# EAGLE design CP Sapling (EAGLE 9.5.2)
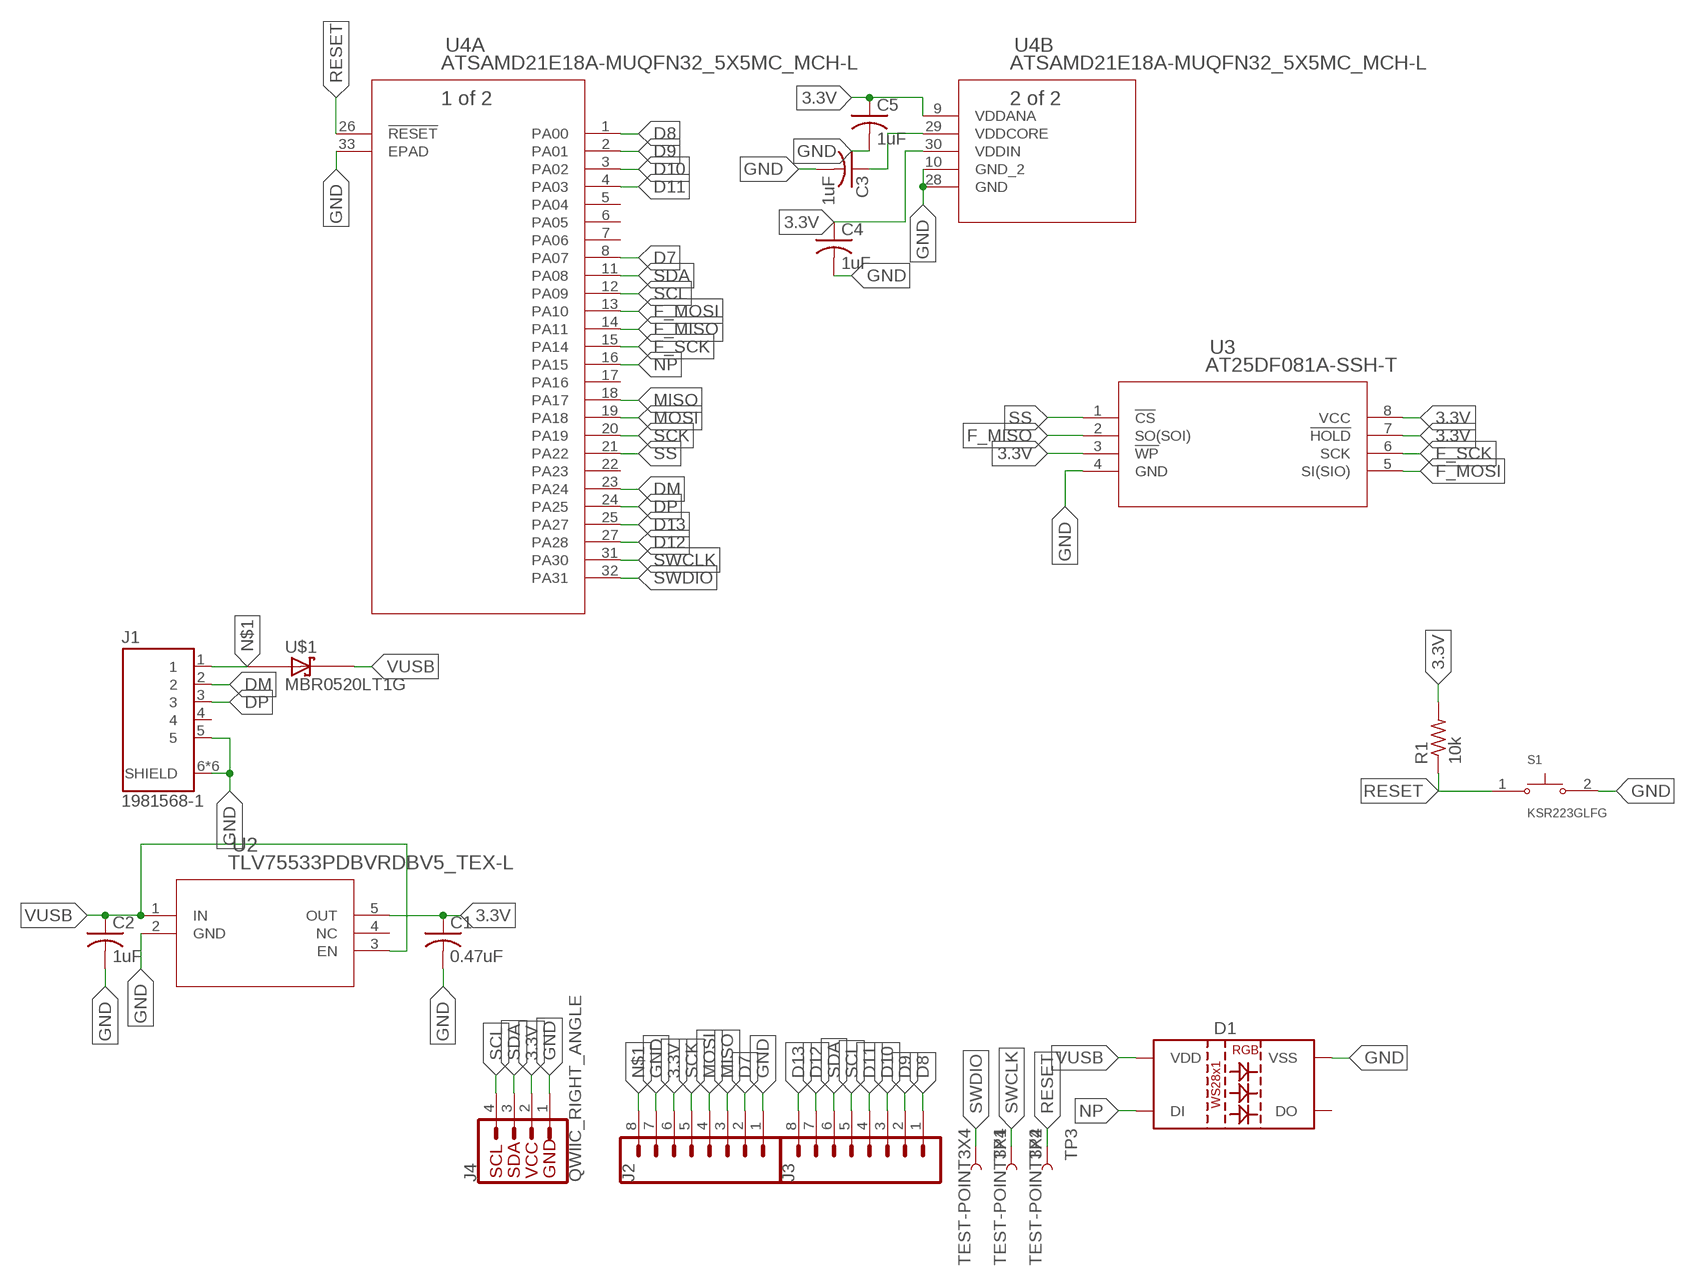
[diagram p0: schematic, sheet 1]

## Parts
C1  0.47uF  C-USC0402  [C0402]
C2  1uF  C-USC0402  [C0402]
C3  1uF  C-USC0402  [C0402]
C4  1uF  C-USC0402  [C0402]
C5  1uF  C-USC0402  [C0402]
D1  WS2812B  WS2812BWS2812B-3535  [WS2812-3535]
J1  1981568-1  [TE_1981568-1]
J2  CONN_08NO_SILK_DNP  [1X08_NO_SILK]
J3  CONN_08NO_SILK_DNP  [1X08_NO_SILK]
J4  QWIIC_RIGHT_ANGLE  QWIIC_CONNECTORJS-1MM  [JST04_1MM_RA]
R1  10k  R-US_R0402  [R0402]
S1  KSR223GLFG  [SW_KSR223GLFG]
TP1  TEST-POINT3X4  [PAD.03X.04]
TP2  TEST-POINT3X4  [PAD.03X.04]
TP3  TEST-POINT3X4  [PAD.03X.04]
U2  TLV75533PDBVRDBV5_TEX-L  [DBV5_TEX-L]
U3  AT25DF081A-SSH-T  [SOIC_AT25DF081_ADO]
U4  ATSAMD21E18A-MUQFN32_5X5MC_MCH-L  [QFN32_5X5MC_MCH-L]
U$1  MBR0520LT1G  [SOD3716X117(SOD-123)]

## Nets
3.3V: C1.1 C4.1 C5.1 J2.6 J4.2 R1.2 U2.5(OUT) U3.3(!WP) U3.7(!HOLD) U3.8(VCC) U4.9(B:VDDANA) U4.30(B:VDDIN)
D7: J2.2 U4.8(A:PA07)
D8: J3.1 U4.1(A:PA00)
D9: J3.2 U4.2(A:PA01)
D10: J3.3 U4.3(A:PA02)
D11: J3.4 U4.4(A:PA03)
D12: J3.7 U4.27(A:PA28)
D13: J3.8 U4.25(A:PA27)
DM: J1.2 U4.23(A:PA24)
DP: J1.3 U4.24(A:PA25)
F_MISO: U3.2(SO(SOI)) U4.14(A:PA11)
F_MOSI: U3.5(SI(SIO)) U4.13(A:PA10)
F_SCK: U3.6(SCK) U4.15(A:PA14)
GND: C1.2 C2.2 C3.2 C4.2 C5.2 D1.VSS J1.5 J1.6(SHIELD) J1.7(SHIELD) J1.8(SHIELD) J1.9(SHIELD) J1.10(SHIELD) J1.11(SHIELD) J2.1 J2.7 J4.1 S1.2 U2.2(GND) U3.4(GND) U4.10(B:GND_2) U4.28(B:GND) U4.33(A:EPAD)
MISO: J2.3 U4.18(A:PA17)
MOSI: J2.4 U4.19(A:PA18)
N$1: J1.1 J2.8 U$1.2(A)
N$2: C3.1 U4.29(B:VDDCORE)
NP: D1.DIN(DI) U4.16(A:PA15)
RESET: R1.1 S1.1 TP3.P$1 U4.26(A:!RESET)
SCK: J2.5 U4.20(A:PA19)
SCL: J3.5 J4.4 U4.12(A:PA09)
SDA: J3.6 J4.3 U4.11(A:PA08)
SS: U3.1(!CS) U4.21(A:PA22)
SWCLK: TP2.P$1 U4.31(A:PA30)
SWDIO: TP1.P$1 U4.32(A:PA31)
VUSB: C2.1 D1.VDD U2.1(IN) U2.3(EN) U$1.1(C)
Unconnected: D1.DOUT(DO) J1.4 U2.4(NC) U4.5(A:PA04) U4.6(A:PA05) U4.7(A:PA06) U4.17(A:PA16) U4.22(A:PA23)

## Library data of the parts
C1-C5 = rcl:C-US: CAPACITOR, American symbol; SPICEPREFIX: C
D1 = SparkFun-LED:WS2812B: WS2812B SMD addressable RGB LED 5x5mm SMD LED with built-in controller IC. Color: Red/Green/Blue mC Rating: RGB: 390, 660, 180 mcd Forward Voltage: RGB: 2.0, 3.0, 3.0 V Packages:WS2812B SparkFun Products: Blynk Board - ESP8266 <https://www.sparkfun.com/products/13794>
J1 = 1981568-1:1981568-1: CONN RCPT MICRO USB B R/A SMD; AVAILABILITY: Unavailable; DESCRIPTION: USB - micro B USB 2.0 Receptacle Connector 5 Position Surface Mount, Right Angle; MF: TE Connectivity; MP: 19815681; PACKAGE: None; PRICE: None; TE_PURCHASE_URL: https://www.te.com/usa-en/product-19815681.html?te_bu=Cor&te_type=disp&te_campaign=seda_glo_cor-seda-global-disp-prtnr-fy19-seda-model-bom-cta_sma-317_1&elqCampaignId=32493
J2 J3 = SparkFun-Connectors:CONN_08: Multi connection point. Often used as Generic Header-pin footprint for 0.1 inch spaced/style header connections On any of the 0.1 inch spaced packages, you can populate with these: Break Away Headers - Straight <https://www.sparkfun.com/products/116> (PRT-00116) Break Away Male Headers - Right Angle <https://www.sparkfun.com/products/553> (PRT-00553) Female Headers <https://www.sparkfun.com/products/115> (PRT-00115) Break Away Headers - Machine Pin <https://www.sparkfun.com/products/117> (PRT-00117) Break Away Female Headers - Swiss Machine Pin <https://www.sparkfun.com/products/743> (PRT-00743) Arduino Stackable Header - 8 Pin <https://www.sparkfun.com/products/9279> (PRT-09279) For SCREWTERMINALS and SPRING TERMINALS visit here: Screw Terimnals on SparkFun.com <https://www.sparkfun.com/search/results?term=Screw+Terminals> (5mm/3.5mm/2.54mm spacing) This device is also useful as a general connection point to wire up your design to another part of your project. Our various solder wires solder well into these plated through hole pads. Hook-Up Wire - Assortment (Stranded, 22 AWG) <https://www.sparkfun.com/products/11375> (PRT-11375) Hook-Up Wire - Assortment (Solid Core, 22 AWG) <https://www.sparkfun.com/products/11367> (PRT-11367) View the entire wire category on our website here <https://www.sparkfun.com/categories/141> Special notes: Molex polarized connector foot print use with SKU : PRT-08231 with associated crimp pins and housings. 1MM SMD Version SKU: PRT-10208 NOTES ON THE VARIANTS LOCK and LOCK_LONGPADS... This footprint was designed to help hold the alignment of a through-hole component (i.e. 6-pin header) while soldering it into place. You may notice that each hole has been shifted either up or down by 0.005 of an inch from it's more standard position (which is a perfectly straight line). This slight alteration caused the pins (the squares in the middle) to touch the edges of the holes. Because they are alternating, it causes a "brace" to hold the component in place. 0.005 has proven to be the perfect amount of "off-center" position when using our standard breakaway headers. Although looks a little odd when you look at the bare footprint, once you have a header in there, the alteration is very hard to notice. Also,if you push a header all the way into place, it is covered up entirely on the bottom side.
J4 = SparkFun-Connectors:QWIIC_CONNECTOR: SparkFun I2C Standard Qwiic Connector An SMD 1mm pitch JST connector makes it easy and quick (get it? Qwiic?) to connect I2C devices to each other. The Qwiic system <http://www.sparkfun.com/qwiic> enables fast and solderless connection between popular platforms and various sensors and actuators. We carry 200mm <https://www.sparkfun.com/products/14204>, 100mm <https://www.sparkfun.com/products/14205>, 50mm <https://www.sparkfun.com/products/14206>, and breadboard friendly <https://www.sparkfun.com/products/14207> Qwiic cables. We also offer 10 pcs strips <https://www.sparkfun.com/products/14323> the SMD connectors.; PROD_ID: CONN-13694
R1 = rcl:R-US_: RESISTOR, American symbol; SPICEPREFIX: R
S1 = KSR223GLFG:KSR223GLFG: Switch Tactile N.O. SPST Round Button Gull Wing 0.01A 32VDC 0.2VA 200000Cycles 2N SMD Automotive T/R; AVAILABILITY: Unavailable; DESCRIPTION: Tactile Switch SPST-NO Top Actuated Surface Mount; MF: C&K; MP: KSR223GLFG; PACKAGE: None; PRICE: None
TP1-TP3 = SparkFun-Connectors:TEST-POINT: SparkFun Test Points Bare copper test points for troubleshooting or In-Circuit-Testing. These are used by our Production team for verifying production board runs using pogo-pins on test beds. SparkFun Products: SparkFun LSM9DS1 Breakout <https://www.sparkfun.com/products/13284> SparkFun PSOC <https://www.sparkfun.com/products/13714> SparkFun Load Cell Amplifier <https://www.sparkfun.com/products/13879>
U2 = TLV75533pdbvr:TLV75533PDBVR; COPYRIGHT: Copyright (C) 2018 Accelerated Designs. All rights reserved; MANUFACTURER_PART_NUMBER: TLV75533PDBVR; SOURCELIBRARY: TI_2019-06-18; VENDOR: Texas Instruments
U3 = AT25DF081A-SSH-T:AT25DF081A-SSH-T; BUILT_BY: EMA_Matt; COPYRIGHT: Copyright (C) 2018 Accelerated Designs. All rights reserved; MANUFACTURER_PART_NUMBER: AT25DF081A-SSH-T; SOURCELIBRARY: Adesto_Technologies_10-16-2019; VENDOR: Adesto Technologies
U4 = ATSAMD21E18A-MU:ATSAMD21E18A-MU; BUILT_BY: EMA_Molly; COPYRIGHT: Copyright (C) 2018 Accelerated Designs. All rights reserved; MANUFACTURER_PART_NUMBER: ATSAMD21E18A-MU; SOURCELIBRARY: Microchip_2019-08-23_25; VENDOR: Microchip
U$1 = MBR0520LT1G:MBR0520LT1G: Surface Mount Schottky Power Rectifier Plastic SOD−123 Package; AVAILABILITY: Unavailable; DESCRIPTION: Diode Schottky 20V 500mA Surface Mount SOD-123; MF: ON Semiconductor; MP: MBR0520LT1G; PACKAGE: SOD-123 ON Semiconductor; PRICE: None

## Board
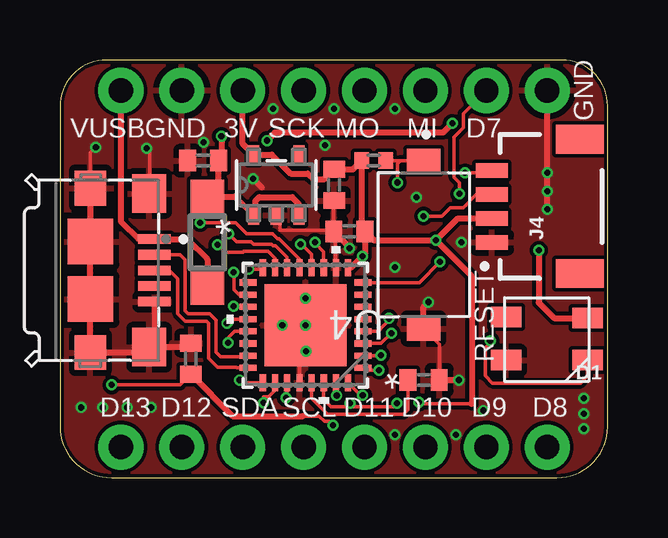
[diagram p1: board, top side]
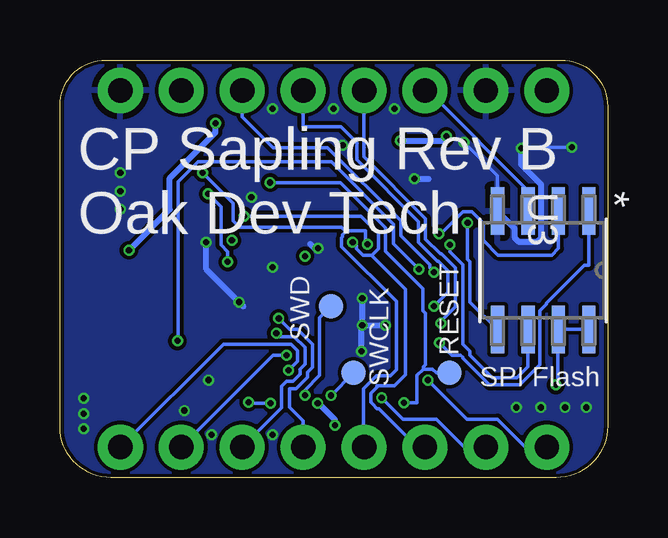
[diagram p2: board, bottom side, seen from below]

Size 22.84 x 17.4 mm. Coordinates in mm from the lower left corner, seen from the top.
Outline: 0,15.45 0,2.15 arc90 2.15,0 20.73,0 arc90 22.84,2.11 22.84,15.49 arc90 20.93,17.4 1.95,17.4 arc90 0,15.45
Copper layers (1*16): Top 0.035mm / dielectric 1.5mm / Bottom 0.035mm
Design rules "default *": minimum track width 6mil, minimum drill 10mil, track to track 6mil, track to pad 6mil, pad to pad 6mil, via to via 6mil, smd to smd 6mil, copper to edge 6mil, drill to drill 6mil, minimum pad ring 4mil, minimum via ring 4mil, stop-mask expansion 4mil, vias tented up to drill 15mil, thermal gap 10mil

### Footprints (pad centres in the part's own frame; a part is rotated, then mirrored left to right if it is on the bottom)
C0402 = smd 0.7 x 0.9: 1 -0.65,0; 2 0.65,0
WS2812-3535 = smd 1.27 x 0.85: DIN 0.05,2.6; DOUT 3.45,0.8; VDD 0.05,0.85; VSS 3.45,2.6
TE_1981568-1 = smd 0.4 x 1.35: 1 -1.3,2.675; 2 -0.65,2.675; 3 0,2.675; 4 0.65,2.675; 5 1.3,2.675 | smd 1.6 x 1.4: 6 -3.2,2.45; 7 3.2,2.45 | smd 1.45 x 1.3: 8 3.425,0; 9 -3.425,0 | smd 1.9 x 1.9: 10 -1.2,0; 11 1.2,0
1X08_NO_SILK = drill 1.016 pad 1.88: 1 0,0; 2 2.54,0; 3 5.08,0; 4 7.62,0; 5 10.16,0; 6 12.7,0; 7 15.24,0; 8 17.78,0
JST04_1MM_RA = smd 0.6 x 1.35: 1 -1.5,0; 2 -0.5,0; 3 0.5,0; 4 1.5,0 | smd 1.2 x 2: NC1 2.8,-3.675; NC2 -2.8,-3.675
R0402 = smd 0.6 x 0.7: 1 -0.5,0; 2 0.5,0
SW_KSR223GLFG = smd 1 x 1.4: 1 -3.5,0; 2 3.5,0
PAD.03X.04 = smd 1.016 x 1.016: P$1 0,0
DBV5_TEX-L = smd 0.775 x 0.457: 1 -1.264,0.95; 2 -1.264,0; 3 -1.264,-0.95; 4 1.264,-0.95; 5 1.264,0.95
SOIC_AT25DF081_ADO = smd 1.981 x 0.559: 1 -2.464,1.905; 2 -2.464,0.635; 3 -2.464,-0.635; 4 -2.464,-1.905; 5 2.464,-1.905; 6 2.464,-0.635; 7 2.464,0.635; 8 2.464,1.905
QFN32_5X5MC_MCH-L = smd 0.711 x 0.254: 1 -2.4,1.778; 2 -2.4,1.27; 3 -2.4,0.762; 4 -2.4,0.254; 5 -2.4,-0.254; 6 -2.4,-0.762; 7 -2.4,-1.27; 8 -2.4,-1.778; 17 2.4,-1.778; 18 2.4,-1.27; 19 2.4,-0.762; 20 2.4,-0.254; 21 2.4,0.254; 22 2.4,0.762; 23 2.4,1.27; 24 2.4,1.778 | smd 0.254 x 0.711: 9 -1.778,-2.4; 10 -1.27,-2.4; 11 -0.762,-2.4; 12 -0.254,-2.4; 13 0.254,-2.4; 14 0.762,-2.4; 15 1.27,-2.4; 16 1.778,-2.4; 25 1.778,2.4; 26 1.27,2.4; 27 0.762,2.4; 28 0.254,2.4; 29 -0.254,2.4; 30 -0.762,2.4; 31 -1.27,2.4; 32 -1.778,2.4 | smd 3.404 x 3.404: 33 0,0
SOD3716X117(SOD-123) = smd 1.4 x 1.4: 1 -1.9,0.051; 2 1.9,0.051

### Placement (x,y rotation side)
C1  11.43,12.19 270 top
C2  5.97,13.21 180 top
C3  15.16,4.06 0 top
C4  5.46,4.95 90 top
C5  12.06,10.26 180 top
D1  22.05,7.49 180 top
J1  1.27,8.64 270 top
J2  20.32,16.13 180 top
J3  20.32,1.27 180 top
J4  18.01,11.3 90 top
R1  13.08,13.21 180 top
S1  15.16,9.7 270 top
TP1  11.53,7.14 0 bottom
TP2  10.59,4.37 0 bottom
TP3  6.6,4.37 0 bottom
U2  9.02,12.19 90 top
U3  2.69,8.64 270 bottom
U4  10.24,6.35 180 top
U$1  6.1,9.8 270 top

### Tracks (layer width: path | path; a pad name or v marks a point on that pad's centre or on a via)
3.3V  (via drill 0.25)
  Top 0.152: U4.30 11,3.25 11.3,2.95 12.06,2.95 | 12.06,2.95 13.9,2.95 v14.06,3.1 | v14.97,3.14 15.13,3.14 15.19,3.07 17.17,3.07 | v11.38,2.18 11.23,2.34 11.02,2.34 10.8,2.56 10.13,2.56 | v2.16,3.86 5.02,3.86 C4.1 | v12.09,3.1 12.09,2.97 12.06,2.95
  Top 0.254: C5.1 12.58,10.4 R1.2 12.21,12.84 C1.1 11.01,12.42 10.57,12.42 10.32,12.66 9.62,12.66 8.83,13.46 U2.5 7.62,13.9 J2.6 | C5.1 12.71,9.32 v12.62,9.23 12.14,8.75 U4.9 | C5.1 13.1,9.88 v15.67,9.88 | J4.2 16.59,10.8 v15.67,9.88 | v15.67,9.88 17.17,8.38 17.17,3.07 | C4.1 7.2,2.56 10.13,2.56
  Bottom 0.152: v14.06,3.1 14.94,3.1 v14.97,3.14 | U3.8 U3.7 2.08,6.15 2.08,3.91 2.13,3.86 v2.16,3.86 | U3.3 3.17,11.25 3.17,11.8 7.5,16.13 J2.6
  Bottom 0.254: v11.38,2.18 11.38,2.41 12.06,3.1 v12.09,3.1
D7  (via drill 0.25)
  Top 0.152: U4.8 14.99,8.13 v15.85,8.99 | v16.66,11.82 16.66,12.29 16.43,12.51 16.43,14.19 16.82,14.57 16.82,15.16 J2.2
  Bottom 0.152: v15.85,8.99 15.85,9.41 16.13,9.69 16.13,11.29 v16.66,11.82
D8  (via drill 0.25)
  Top 0.152: U4.1 12.74,4.47 v13.31,4.47
  Bottom 0.152: J3.1 16.03,5.56 13.2,5.56 12.93,5.29 12.93,4.85 v13.31,4.47
D9  (via drill 0.25)
  Top 0.152: U4.2 13.36,5.08 v13.39,5.11
  Bottom 0.152: v13.39,5.11 13.95,5.11 J3.2
D10  (via drill 0.25)
  Top 0.152: v13.82,6.02 13.39,5.59 U4.3
  Bottom 0.152: v13.82,6.02 13.66,5.87 13.07,5.87 12.62,5.42 12.62,4.72 12.83,4.52 12.83,4.31 13.12,4.01 13.38,4.01 13.6,3.8 13.6,2.91 J3.3
D11  (via drill 0.25)
  Top 0.152: U4.4 13.28,6.1 13.36,6.17 13.36,6.21 13.63,6.48 13.72,6.48 v13.72,6.63
  Bottom 0.152: v13.72,6.63 13.26,6.17 12.98,6.17 12.94,6.17 12.32,5.55 12.32,4.6 12.52,4.4 12.52,4.18 12.99,3.71 13.26,3.71 13.26,2.92 12.7,2.36 J3.4
D12  (via drill 0.25)
  Top 0.152: U4.27 9.47,3.38 v9.42,3.33
  Bottom 0.152: v9.42,3.33 8.53,2.44 7.14,2.44 5.97,1.27 J3.7
D13  (via drill 0.25)
  Top 0.152: U4.25 7.61,3.95 v7.49,4.06
  Bottom 0.152: v7.49,4.06 5.87,2.44 4.6,2.44 3.43,1.27 J3.8
DM
  Top 0.152: J1.2 5.01,9.29 5.22,9.08 5.22,6.96 5.35,6.82 6.23,6.82 6.5,6.55 6.5,5.23 6.71,5.03 7.79,5.03 U4.23
DP
  Top 0.152: U4.24 7.38,4.57 7.35,4.6 6.58,4.6 6.2,4.98 6.2,6.43 6.11,6.52 5.23,6.52 4.91,6.83 4.91,8.28 4.56,8.64 J1.3
F_MISO  (via drill 0.25)
  Top 0.152: U4.14 9.47,9.18 9,9.65 8.89,9.65 8.81,9.73 8.08,9.73 7.98,9.83 7.37,9.83 v7.04,10.16
  Bottom 0.152: v7.04,10.16 6.95,10.16 6.03,11.07 5.65,11.07 5.18,10.6 5.18,9.88 4.57,9.27 2.34,9.27 2.06,9.55 U3.2
F_MOSI  (via drill 0.25)
  Top 0.152: U4.13 9.98,9.1 9.12,9.96 9.07,9.96 8.87,10.16 7.78,10.16 7.33,10.62 v5.84,10.62
  Bottom 0.152: v5.84,10.62 5.84,9.1 5.74,9 5.74,7.32 U3.5
F_SCK  (via drill 0.25)
  Top 0.152: U4.15 8.97,9.14 8.69,9.42 7.66,9.42 7.63,9.4 6.88,9.4 v6.58,9.7
  Bottom 0.152: v6.58,9.7 6.58,9.41 6.04,8.88 6.04,5.56 5.74,5.26 5.74,5.11 4.8,4.17 3.79,4.17 3.33,4.62 U3.6
GND  (via drill 0.25)
  Top 0.152: U4.10 11.51,8.78 11.48,8.8 11.48,10.2 C5.2 | C5.2 11.41,11.53 C1.2 | U2.2 9.17,10.78 9.17,10.31 11.36,10.31 C5.2 | S1.2 15.81,5.55 C3.2 | U4.28 9.98,6.1 U4.33 | 5.32,13.29 C2.2 | J1.9 1.27,13.54 v1.5,13.77 | v3.61,13.72 3.73,13.59 3.73,11.84
  Top 0.254: J1.5 3.94,5.66 J1.7 | C4.2 5.29,5.44 J1.7 | J1.7 3.5,5.21 J1.8 J1.11 J1.10 J1.9 | 3.95,11.84 3.73,11.84 J1.6 | 20.32,11.2 v20.32,11.94 v20.32,12.7 J2.1 | S1.2 15.16,7.11 v15.37,7.32 | C5.2 12.08,9.6 v12.08,9.56 | 8.41,12.09 v8.05,12.45 | v16.64,4.06 C3.2
  Bottom 0.152: U3.4 4.6,12.57 v5.99,13.97 | v1.5,13.77 3.56,13.77 v3.61,13.72
  Bottom 0.254: 15.19,7.14 v15.37,7.32 16.74,8.69 v16.74,9.8 | v12.08,9.56 12.23,9.56 12.41,9.73 | v8.05,12.45 7.47,12.45 | U3.4 3.89,10.39 3.89,9.99 3.72,9.83 2.93,9.83 2.77,9.99 2.77,12.21 3.61,13.04 v3.61,13.72 | v10.24,7.47 U4.33 | U4.33 v9.27,6.35 | v10.26,5.26 10.26,6.33 U4.33
  other vias: 10.24,6.35 11.43,15.37 13.97,15.37 14.86,11.68 0.89,2.92 1.78,2.92 2.79,2.92 3.81,2.92 13.97,1.78 16.51,1.78 17.65,2.79 8.89,15.37 13.97,8.76 20.32,11.18 11.05,13.84 21.84,3.3 21.84,2.67 21.84,2.03
  pour Bottom: -1.27,19.05 24.13,19.05 24.13,-1.27 -1.27,-1.27
  pour Top: -0.25,18.8 23.5,18.8 23.62,18.67 23.62,-0.38 23.5,-0.51 0,-0.51 -0.25,-0.25
MISO  (via drill 0.25)
  Top 0.152: U4.18 7.47,7.62 7.25,7.84 7.25,8.35 | 7.25,8.35 7.26,8.36 | v7.24,8.56 7.25,8.55 7.25,8.35
  Bottom 0.152: J2.3 15.24,15.04 13.95,13.74 11.68,13.74 8.63,10.69 8.63,10.09 7.42,8.88 7.42,8.74 v7.24,8.56
MOSI  (via drill 0.25)
  Top 0.152: 7.81,7.14 U4.19 7.26,7.11 v7.24,7.14
  Bottom 0.152: J2.4 12.7,14.61 11.13,14.61 10.46,13.95 10.46,13.23 7.9,10.67 7.9,9.81 7.11,9.02 7.05,9.02 6.66,8.62 6.66,7.72 v7.24,7.14
N$1
  Top 0.254: U$1.2 6.15,9.09 5.3,9.94 J1.1 3.27,9.94 2.54,10.67 J2.8
N$2
  Top 0.152: C3.1 14.51,2.83 14.33,2.64 11.15,2.64 10.49,3.3 U4.29
NP  (via drill 0.25)
  Top 0.152: U4.16 8.39,8.69 v7.87,8.69 | v17.94,5.7 17.94,5.62 17.73,5.41 17.73,4.24 18.03,3.94 21.72,3.94 22,4.22 D1.DIN
  Bottom 0.152: v7.87,8.69 8.93,9.74 8.93,10.56 11.52,13.16 17.08,13.16 17.91,12.33 17.91,5.73 v17.94,5.7
RESET  (via drill 0.25)
  Top 0.152: R1.1 14.2,13.2 | 14.2,13.2 S1.1 | U4.26 8.97,3.63 8.7,3.37 8.49,3.37 v8.49,3.12 | v14.07,12.29 14.07,13.08 14.2,13.2
  Bottom 0.152: v8.49,3.12 7.95,3.12 7.95,4.25 7.68,4.52 | 7.68,4.52 7.3,4.52 7.15,4.37 TP3.P$1 | 7.68,4.52 7.68,4.61 7.59,4.7 7.59,6.85 7.7,6.95 7.7,7.86 9.26,9.43 9.26,10.4 11.15,12.29 v14.07,12.29
SCK  (via drill 0.25)
  Top 0.152: v6.96,6.43 7.14,6.6 U4.20
  Bottom 0.152: v6.96,6.43 6.96,6.52 6.35,7.13 6.35,8.75 6.92,9.32 6.98,9.32 7.59,9.94 7.59,10.79 10.16,13.36 J2.5
SCL  (via drill 0.25)
  Top 0.152: v10.02,9.72 10.08,9.72 10.49,9.3 U4.12 | J4.4 17.91,12.7 v16.89,12.7
  Bottom 0.152: 10.91,10.25 11.05,10.11 11.05,10.03 11.09,9.99 11.09,9.62 8.81,7.34 8.81,4.5 9.07,4.24 9.65,4.24 10.19,3.71 10.19,1.29 J3.5 | 10.91,10.25 10.87,10.29 10.1,10.29 10.1,9.79 v10.02,9.72 | 10.91,10.25 11.1,10.44 15.35,10.44 15.62,10.71 15.62,11.43 v16.89,12.7
SDA  (via drill 0.25)
  Top 0.152: v10.63,9.8 10.63,9.78 11,9.41 U4.11 | v15.16,10.9 15.93,10.9 16.27,11.24 16.82,11.24 17.37,11.8 J4.3
  Bottom 0.152: J3.6 7.94,1.27 9.54,2.87 9.61,2.87 9.82,3.07 9.88,3.14 9.88,3.52 9.63,3.77 9.63,3.83 8.89,3.83 8.43,4.29 8.43,7.84 9.85,9.26 | v10.63,9.8 10.48,9.65 10.48,9.53 10.21,9.26 9.85,9.26 | v15.16,10.9 10.28,10.9 9.57,10.19 9.57,9.53 9.83,9.26 9.85,9.26
SS  (via drill 0.25)
  Top 0.152: U4.21 7.29,6.1 7.01,5.82 v7.01,5.61
  Bottom 0.152: U3.1 0.79,8.84 0.98,8.84 2.56,7.26 2.56,7.21 2.82,6.96 2.82,4.7 3.66,3.86 4.93,3.86 6.04,4.98 6.04,5 6.15,5.11 6.5,5.11 v7.01,5.61
SWCLK  (via drill 0.25)
  Top 0.152: U4.31 11.51,3.45 v11.54,3.42
  Bottom 0.152: v11.54,3.42 TP2.P$1
SWDIO  (via drill 0.25)
  Top 0.152: v12.62,3.43 12.54,3.43 U4.32
  Bottom 0.152: TP1.P$1 12.01,6.66 12.01,4.26 12.62,3.65 v12.62,3.43
VUSB  (via drill 0.25)
  Top 0.254: U2.3 9.97,11.39 9.68,11.68 8.31,11.68 8.15,11.53 8.15,11.02 U2.1 7.29,11.7 U$1.1 6.62,12.18 C2.1 6.73,13.32 v6.73,14.22 | v16.36,14.76 15.98,14.38 8.97,14.38 v8.63,14.04 | v19.96,9.47 19.96,7.29 20.61,6.64 D1.VDD
  Bottom 0.254: v19.96,9.47 18.26,11.18 18.26,12.48 16.36,14.38 v16.36,14.76 | v8.63,14.04 6.73,14.04 v6.73,14.22

### Text on the board
tNames: VUSB | GND | 3V | SCK | MO | MI | D7 | GND | RESET | D13 | D12 | SDA | SCL | D11 | D10 | D9 | D8
bNames: CP Sapling Rev B / Oak Dev Tech | SWD | RESET | SPI Flash | SWCLK